# EAGLE design untitled-bruecke (EAGLE 6.3)
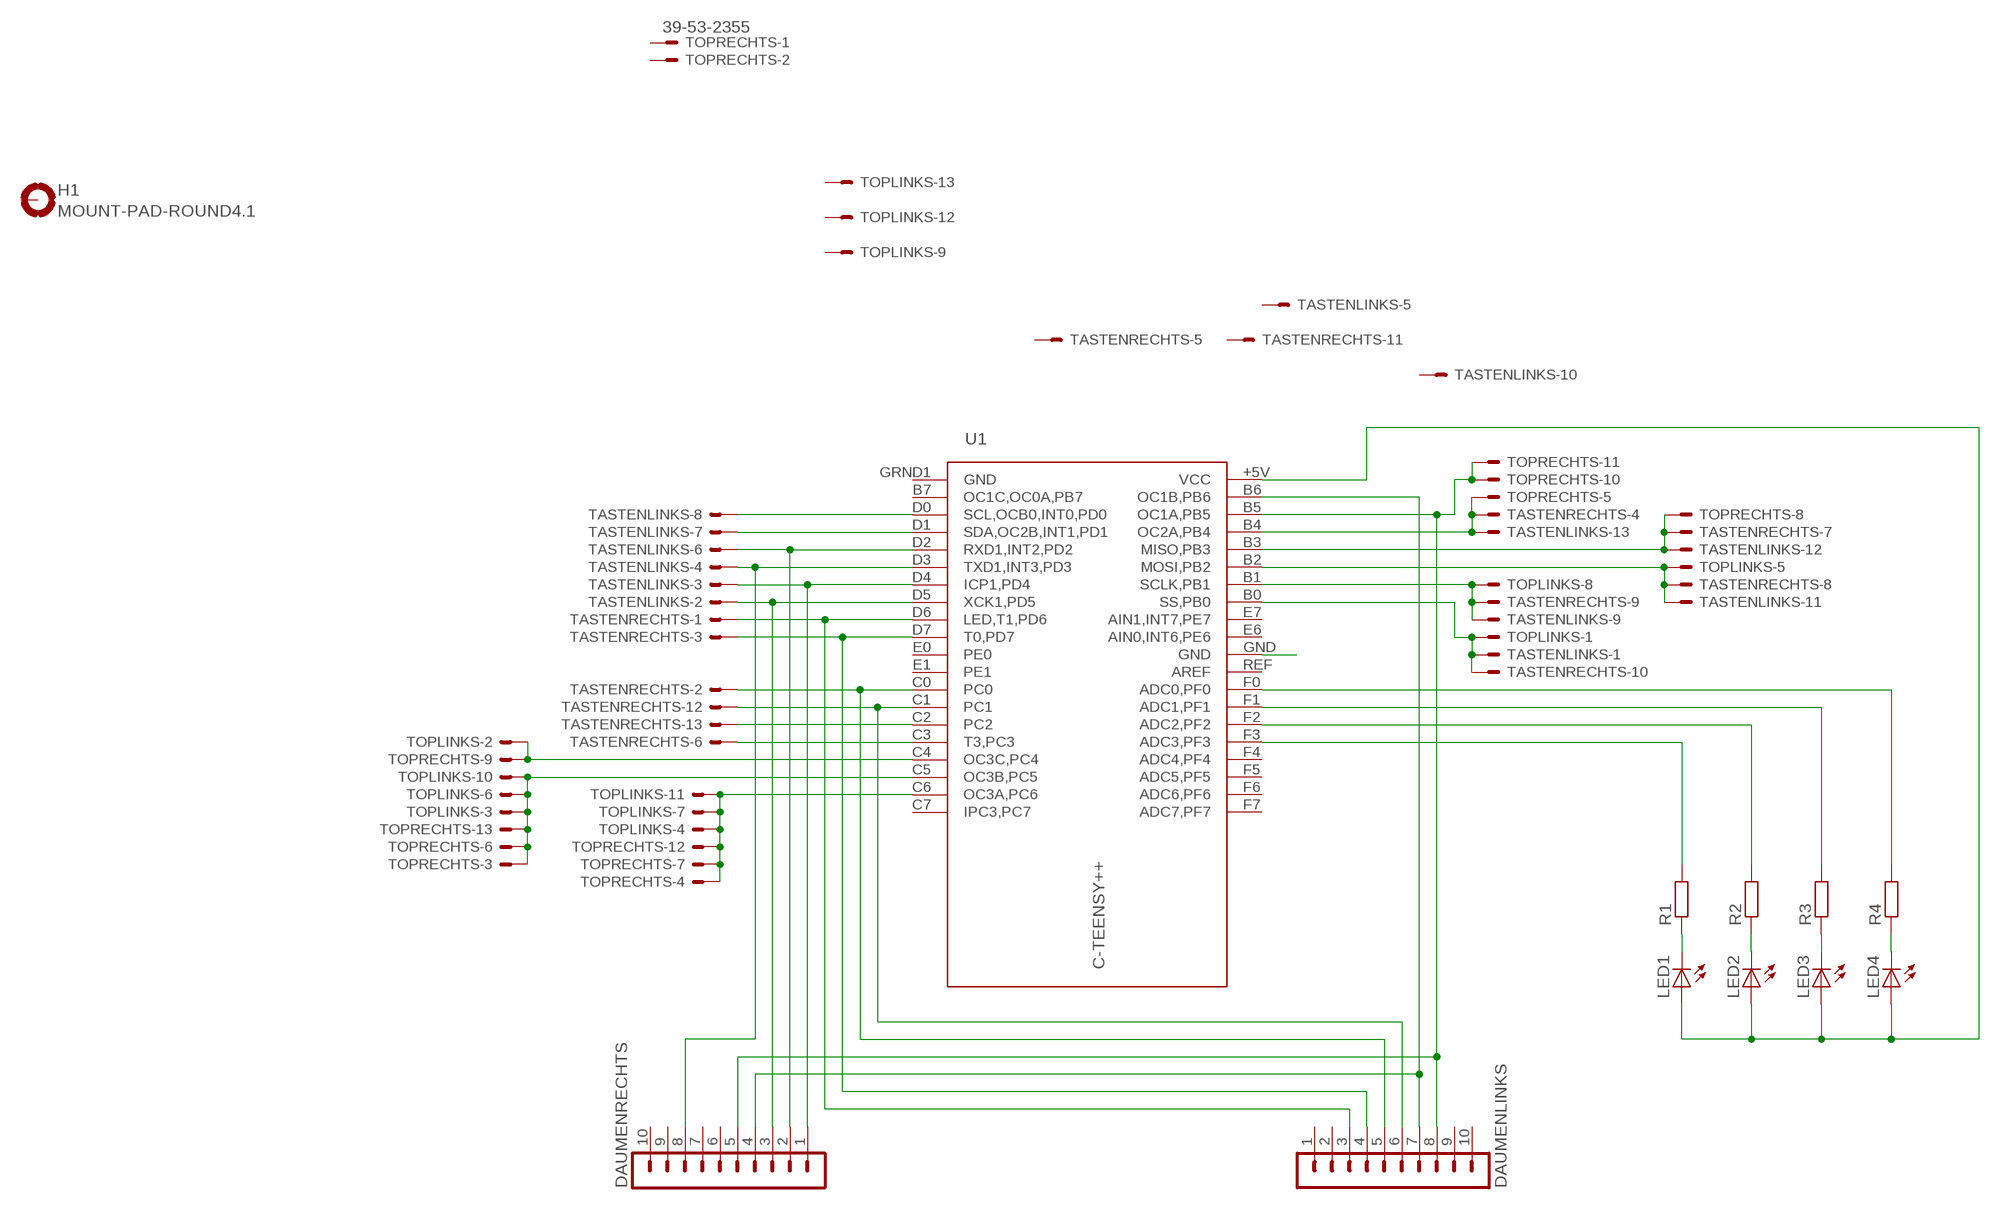
[diagram p0: schematic, sheet 1]

## Parts
DAUMENLINKS  MA10-1  [MA10-1]
DAUMENRECHTS  MA10-1  [MA10-1]
H1  MOUNT-PAD-ROUND4.1  [4,1-PAD]
LED1  LED3MM  [LED3MM]
LED2  LED3MM  [LED3MM]
LED3  LED3MM  [LED3MM]
LED4  LED3MM  [LED3MM]
R1  R-EU_R1206  [R1206]
R2  R-EU_R1206  [R1206]
R3  R-EU_R1206  [R1206]
R4  R-EU_R1206  [R1206]
TASTENLINKS  39-53-2355  [39-53-2135]
TASTENRECHTS  39-53-2355  [39-53-2135]
TOPLINKS  39-53-2355  [39-53-2135]
TOPRECHTS  39-53-2355  [39-53-2135]
U1  C-TEENSY++  [TEENSY++]

## Nets
B0: TASTENLINKS.P$1 TASTENRECHTS.P$10 TOPLINKS.P$1 U1.B0(SS,PB0)
B1: TASTENLINKS.P$9 TASTENRECHTS.P$9 TOPLINKS.P$8 U1.B1(SCLK,PB1)
B2: TASTENLINKS.P$11 TASTENRECHTS.P$8 TOPLINKS.P$5 U1.B2(MOSI,PB2)
B3: TASTENLINKS.P$12 TASTENRECHTS.P$7 TOPRECHTS.P$8 U1.B3(MISO,PB3)
B4: TASTENLINKS.P$13 TASTENRECHTS.P$4 TOPRECHTS.P$5 U1.B4(OC2A,PB4)
B5: DAUMENLINKS.8 DAUMENRECHTS.5 TOPRECHTS.P$10 TOPRECHTS.P$11 U1.B5(OC1A,PB5)
B6: DAUMENLINKS.7 DAUMENRECHTS.4 U1.B6(OC1B,PB6)
C0: DAUMENLINKS.5 TASTENRECHTS.P$2 U1.C0
C1: DAUMENLINKS.6 TASTENRECHTS.P$12 U1.C1
C2: TASTENRECHTS.P$13 U1.C2
C3: TASTENRECHTS.P$6 U1.C3(T3,PC3)
C4: TOPLINKS.P$2 TOPRECHTS.P$9 U1.C4(OC3C,PC4)
C5: TOPLINKS.P$3 TOPLINKS.P$6 TOPLINKS.P$10 TOPRECHTS.P$3 TOPRECHTS.P$6 TOPRECHTS.P$13 U1.C5(OC3B,PC5)
C6: TOPLINKS.P$4 TOPLINKS.P$7 TOPLINKS.P$11 TOPRECHTS.P$4 TOPRECHTS.P$7 TOPRECHTS.P$12 U1.C6(OC3A,PC6)
D0: TASTENLINKS.P$8 U1.D0(SCL,OCB0,INT0,PD0)
D1: TASTENLINKS.P$7 U1.D1(SDA,OC2B,INT1,PD1)
D2: DAUMENRECHTS.2 TASTENLINKS.P$6 U1.D2(RXD1,INT2,PD2)
D3: DAUMENRECHTS.8 TASTENLINKS.P$4 U1.D3(TXD1,INT3,PD3)
D4: DAUMENRECHTS.1 TASTENLINKS.P$3 U1.D4(ICP1,PD4)
D5: DAUMENRECHTS.3 TASTENLINKS.P$2 U1.D5(XCK1,PD5)
D6: DAUMENLINKS.3 TASTENRECHTS.P$1 U1.D6(LED,T1,PD6)
D7: DAUMENLINKS.4 TASTENRECHTS.P$3 U1.D7(T0,PD7)
N$1: U1.GND
N$7: R1.2 U1.F3(ADC3,PF3)
N$8: R2.2 U1.F2(ADC2,PF2)
N$9: R3.2 U1.F1(ADC1,PF1)
N$10: R4.2 U1.F0(ADC0,PF0)
N$11: LED1.A LED2.A LED3.A LED4.A U1.+5V(VCC)
N$14: LED4.K(C) R4.1
N$15: LED3.K(C) R3.1
N$16: LED2.K(C) R2.1
N$17: LED1.K(C) R1.1
Unconnected: DAUMENLINKS.1 DAUMENLINKS.2 DAUMENLINKS.9 DAUMENLINKS.10 DAUMENRECHTS.6 DAUMENRECHTS.7 DAUMENRECHTS.9 DAUMENRECHTS.10 H1.B4,1(MOUNT) TASTENLINKS.P$5 TASTENLINKS.P$10 TASTENRECHTS.P$5 TASTENRECHTS.P$11 TOPLINKS.P$9 TOPLINKS.P$12 TOPLINKS.P$13 TOPRECHTS.P$1 TOPRECHTS.P$2 U1.B7(OC1C,OC0A,PB7) U1.C7(IPC3,PC7) U1.E0 U1.E1 U1.E6(AIN0,INT6,PE6) U1.E7(AIN1,INT7,PE7) U1.F4(ADC4,PF4) U1.F5(ADC5,PF5) U1.F6(ADC6,PF6) U1.F7(ADC7,PF7) U1.REF(AREF)

## Power pins joined to a net without a drawn wire
GND: U1.GRND1(GND)

## Library data of the parts
DAUMENLINKS DAUMENRECHTS = con-lstb:MA10-1: PIN HEADER; OC_FARNELL: unknown; OC_NEWARK: unknown
H1 = holes:MOUNT-PAD-ROUND: MOUNTING PAD, round
LED1-LED4 = led:LED: LED OSRAM: - CHIPLED LG R971, LG N971, LY N971, LG Q971, LY Q971, LO R971, LY R971 LH N974, LH R974 LS Q976, LO Q976, LY Q976 LO Q996 - Hyper CHIPLED LW Q18S LB Q993, LB Q99A, LB R99A - SideLED LS A670, LO A670, LY A670, LG A670, LP A670 LB A673, LV A673, LT A673, LW A673 LH A674 LY A675 LS A676, LA A676, LO A676, LY A676, LW A676 LS A679, LY A679, LG A679 - Hyper Micro SIDELED® LS Y876, LA Y876, LO Y876, LY Y876 LT Y87S - SmartLED LW L88C, LW L88S LB L89C, LB L89S, LG L890 LS L89K, LO L89K, LY L89K LS L896, LA L896, LO L896, LY L896 - TOPLED LS T670, LO T670, LY T670, LG T670, LP T670 LSG T670, LSP T670, LSY T670, LOP T670, LYG T670 LG T671, LOG T671, LSG T671 LB T673, LV T673, LT T673, LW T673 LH T674 LS T676, LA T676, LO T676, LY T676, LB T676, LH T676, LSB T676, LW T676 LB T67C, LV T67C, LT T67C, LS T67K, LO T67K, LY T67K, LW E67C LS E67B, LA E67B, LO E67B, LY E67B, LB E67C, LV E67C, LT E67C LW T67C LS T679, LY T679, LG T679 LS T770, LO T770, LY T770, LG T770, LP T770 LB T773, LV T773, LT T773, LW T773 LH T774 LS E675, LA E675, LY E675, LS T675 LS T776, LA T776, LO T776, LY T776, LB T776 LHGB T686 LT T68C, LB T68C - Hyper Mini TOPLED® LB M676 - Mini TOPLED Santana® LG M470 LS M47K, LO M47K, LY M47K Source: http://www.osram.convergy.de/
R1-R4 = rcl:R-EU_: RESISTOR, European symbol
TASTENLINKS TASTENRECHTS TOPLINKS TOPRECHTS = con-molex-39-53:39-53-2355
U1 = teensypp:C-TEENSY++

## Board
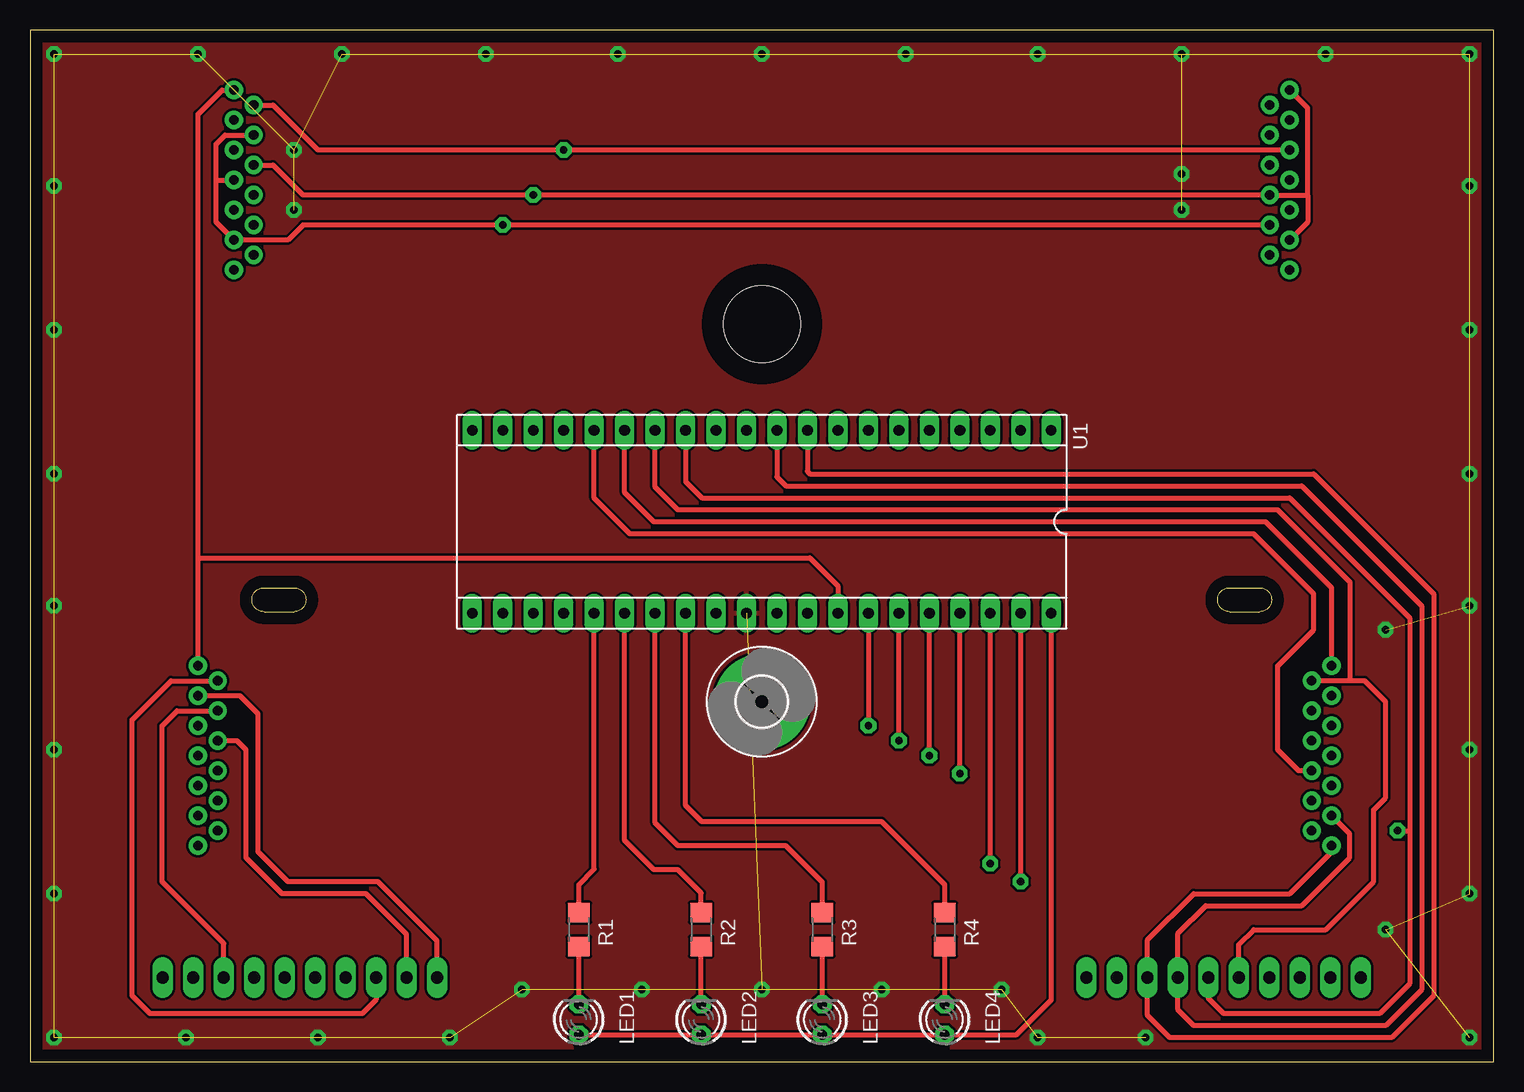
[diagram p1: board, top side]
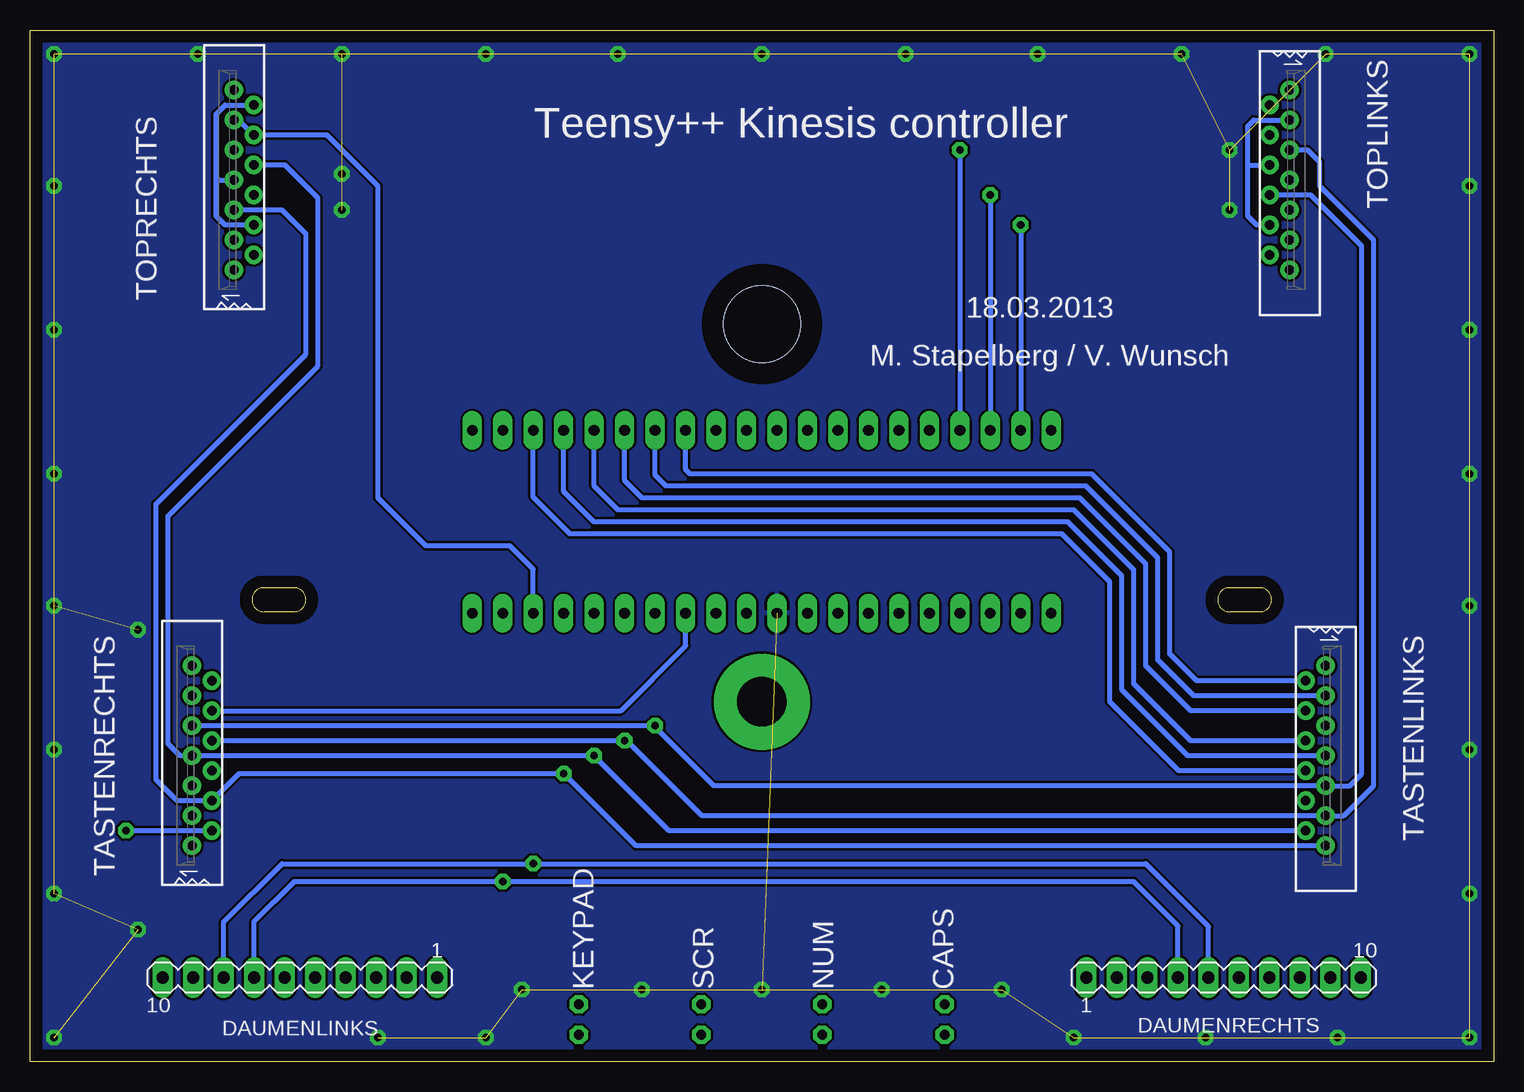
[diagram p2: board, bottom side, seen from below]

Size 122 x 86 mm. Coordinates in mm from the lower left corner, seen from the top.
Outline: 0,0 122,0 122,86 0,86 0,0
Outline: 19.5,37.5 22,37.5 arc90 23,38.5 arc90 22,39.5 19.5,39.5 arc90 18.5,38.5 arc90 19.5,37.5
Outline: 100,37.5 102.5,37.5 arc90 103.5,38.5 arc90 102.5,39.5 100,39.5 arc90 99,38.5 arc90 100,37.5
Copper layers (1*16): Top 0.035mm / dielectric 1.5mm / Bottom 0.035mm
Design rules "default": minimum track width 10mil, minimum drill 0.6mm, track to track 8mil, track to pad 8mil, pad to pad 8mil, via to via 8mil, smd to smd 8mil, copper to edge 40mil, drill to drill 8mil, minimum pad ring 14mil, minimum via ring 14mil, stop-mask expansion 4mil, vias tented up to drill 0.65mm, thermal gap 10mil
Holes 6.4 mm at 61,61.5
tKeepout: area 56,56.5 to 66,66.5
bKeepout: area 56,56.5 to 66,66.5
tRestrict: area 56,56.5 to 66,66.5
bRestrict: area 56,56.5 to 66,66.5
vRestrict: area 56,56.5 to 66,66.5

### Footprints (pad centres in the part's own frame; a part is rotated, then mirrored left to right if it is on the bottom)
MA10-1 = drill 1.016 long: 1 -11.43,0; 2 -8.89,0; 3 -6.35,0; 4 -3.81,0; 5 -1.27,0; 6 1.27,0; 7 3.81,0; 8 6.35,0; 9 8.89,0; 10 11.43,0
4,1-PAD = drill 4.1 pad 8: B4,1 0,0
LED3MM = drill 0.813 octagon: A -1.27,0; K 1.27,0
R1206 = smd 1.6 x 1.803: 1 -1.422,0; 2 1.422,0
39-53-2135 = drill 0.8: P$1 -7.5,0; P$2 -6.25,-1.65; P$3 -5,0; P$4 -3.75,-1.65; P$5 -2.5,0; P$6 -1.25,-1.65; P$7 0,0; P$8 1.25,-1.65; P$9 2.5,0; P$10 3.75,-1.65; P$11 5,0; P$12 6.25,-1.65; P$13 7.5,0
TEENSY++ = drill 0.9 long: +5V -24.13,7.62; B0 -6.35,7.62; B1 -8.89,7.62; B2 -11.43,7.62; B3 -13.97,7.62; B4 -16.51,7.62; B5 -19.05,7.62; B6 -21.59,7.62; B7 -21.59,-7.62; C0 6.35,-7.62; C1 8.89,-7.62; C2 11.43,-7.62; C3 13.97,-7.62; C4 16.51,-7.62; C5 19.05,-7.62; C6 21.59,-7.62; C7 24.13,-7.62; D0 -19.05,-7.62; D1 -16.51,-7.62; D2 -13.97,-7.62; D3 -11.43,-7.62; D4 -8.89,-7.62; D5 -6.35,-7.62; D6 -3.81,-7.62; D7 -1.27,-7.62; E0 1.27,-7.62; E1 3.81,-7.62; E6 -1.27,7.62; E7 -3.81,7.62; F0 6.35,7.62; F1 8.89,7.62; F2 11.43,7.62; F3 13.97,7.62; F4 16.51,7.62; F5 19.05,7.62; F6 21.59,7.62; F7 24.13,7.62; GND -24.13,-7.62; GRND1 1.27,7.62; REF 3.81,7.62

### Placement (x,y rotation side)
DAUMENLINKS  99.5,7 180 bottom
DAUMENRECHTS  22.5,7 0 bottom
H1  61,30 0 top
LED1  45.75,3.5 90 top
LED2  55.95,3.5 90 top
LED3  66.05,3.5 90 top
LED4  76.25,3.5 90 top
R1  45.75,11 90 top
R2  55.95,11 90 top
R3  66.05,11 90 top
R4  76.25,11 90 top
TASTENLINKS  14,25.5 270 bottom
TASTENRECHTS  108.5,25.5 90 bottom
TOPLINKS  17,73.5 270 bottom
TOPRECHTS  105,73.5 90 bottom
U1  61,45 180 top

### Tracks (layer width: path | path; a pad name or v marks a point on that pad's centre or on a via)
B0
  Top 0.406: TASTENLINKS.P$1 14,42 | 14,42 65,42 67.35,39.65 U1.B0 | 14,42 14,79 16,81 TOPLINKS.P$1
  Bottom 0.406: TASTENRECHTS.P$10 72.75,29.25 67.35,34.65 U1.B0
B1  (via drill 0.6)
  Top 0.406: U1.B1 v69.89,28
  Bottom 0.406: 70,28 65,23 TASTENLINKS.P$9 12,23 11,24 11,68 15.25,72.25 TOPLINKS.P$8 | 70,28 TASTENRECHTS.P$9 | v69.89,28 70,28
B2  (via drill 0.6)
  Top 0.406: v72.43,26.75 U1.B2
  Bottom 0.406: TASTENRECHTS.P$8 v72.43,26.75 72.25,26.75 66,20.5 TASTENLINKS.P$11 12.5,20.5 10,23 10,68.5 14.5,73 14.5,75 15.5,76 TOPLINKS.P$5
B3  (via drill 0.6)
  Top 0.406: v74.97,25.5 U1.B3
  Bottom 0.406: TASTENLINKS.P$12 68.75,19.25 75,25.5 | 75,25.5 TASTENRECHTS.P$7 109.5,25.5 110.5,26.5 110.5,45.5 98,58 98,72 100.75,74.75 TOPRECHTS.P$8 | 75,25.5 v74.97,25.5
B4  (via drill 0.6)
  Top 0.406: v77.51,24 U1.B4
  Bottom 0.406: TASTENLINKS.P$13 71.5,18 v77.5,24 v77.51,24 104.6,24 TASTENRECHTS.P$4 109.75,21.75 111.5,23.5 111.5,46.5 99,59 99,69 101,71 TOPRECHTS.P$5
B5  (via drill 0.6)
  Top 0.406: v80.05,16.5 U1.B5
  Bottom 0.406: DAUMENLINKS.8 105.85,11.65 101,16.5 v80.05,16.5 29,16.5 23.77,11.27 DAUMENRECHTS.5 | U1.B5 80.05,41.05 82,43 89,43 93,47 93,73 97.25,77.25 TOPRECHTS.P$10 104.6,78.5 TOPRECHTS.P$11
B6  (via drill 0.6)
  Top 0.406: v82.59,15 U1.B6
  Bottom 0.406: DAUMENRECHTS.4 26.31,11.31 30,15 v82.59,15 100,15 103.31,11.69 DAUMENLINKS.7
C0  (via drill 0.6)
  Top 0.406: U1.C0 54.65,48.35 56,47 105,47 115,37 115,19.25 | 115,19.25 115,6.5 112.5,4 99.5,4 98.23,5.27 DAUMENLINKS.5 | v114,19.25 115,19.25
  Bottom 0.406: TASTENRECHTS.P$2 v114,19.25
C1
  Top 0.406: DAUMENLINKS.6 100.77,9.77 102,11 108,11 112,15 112,21 113,22 113,30 111.25,31.75 110.05,31.75 | 110.05,31.75 TASTENRECHTS.P$12 | 110.05,31.75 110.05,39.95 104,46 54,46 52.11,47.89 U1.C1
C2
  Top 0.406: TASTENRECHTS.P$13 108.5,39.5 103,45 52,45 49.57,47.43 U1.C2
C3
  Top 0.406: TASTENRECHTS.P$6 105.75,24.25 104,26 104,33 107,36 107,39 102,44 50,44 47.03,46.97 U1.C3
C4  (via drill 0.6)
  Top 0.406: TOPRECHTS.P$9 v44.49,76 24,76 20.25,79.75 TOPLINKS.P$2
  Bottom 0.406: v44.49,76 U1.C4
C5  (via drill 0.6)
  Top 0.406: TOPLINKS.P$6 20.25,74.75 22.75,72.25 v41.95,72.25 TOPRECHTS.P$6 106.5,72.25 | 106.5,72.25 106.5,70 TOPRECHTS.P$3 | 106.5,72.25 106.5,79.5 TOPRECHTS.P$13
  Bottom 0.406: TOPLINKS.P$10 19.75,69.75 20.5,70.5 20.5,74.75 | 20.5,74.75 TOPLINKS.P$6 | 20.5,74.75 20.5,78 20,78.5 TOPLINKS.P$3 | v41.95,72.25 U1.C5
C6  (via drill 0.6)
  Top 0.406: TOPRECHTS.P$4 v39.41,69.75 22.75,69.75 21.5,68.5 TOPLINKS.P$11 15.5,70 15.5,73.5 | 15.5,73.5 TOPLINKS.P$7 | 15.5,73.5 15.5,76.5 16.25,77.25 TOPLINKS.P$4
  Bottom 0.406: TOPRECHTS.P$4 105.75,69.75 106.5,70.5 106.5,73.5 | 106.5,73.5 TOPRECHTS.P$7 | 106.5,73.5 106.5,79 105.75,79.75 TOPRECHTS.P$12 | v39.41,69.75 U1.C6
D0
  Bottom 0.406: TASTENLINKS.P$8 26.25,24.25 32,30 32,40 36,44 77,44 80.05,47.05 U1.D0
D1
  Bottom 0.406: TASTENLINKS.P$7 25.5,25.5 31,31 31,40.5 35.5,45 75,45 77.51,47.51 U1.D1
D2
  Top 0.406: DAUMENRECHTS.2 31.39,10.61 28,14 21,14 18,17 18,26 17.25,26.75 TASTENLINKS.P$6
  Bottom 0.406: TASTENLINKS.P$6 25.25,26.75 30,31.5 30,41 35,46 73,46 74.97,47.97 U1.D2
D3
  Top 0.406: DAUMENRECHTS.8 16.15,9.85 11,15 11,28 12.25,29.25 TASTENLINKS.P$4
  Bottom 0.406: TASTENLINKS.P$4 25.25,29.25 29,33 29,41.5 34.5,47 71,47 72.43,48.43 U1.D3
D4
  Top 0.406: DAUMENRECHTS.1 33.93,10.07 29,15 21.5,15 19,17.5 19,29 17.5,30.5 TASTENLINKS.P$3
  Bottom 0.406: TASTENLINKS.P$3 25,30.5 28,33.5 28,42 34,48 69,48 69.89,48.89 U1.D4
D5
  Top 0.406: DAUMENRECHTS.3 28.85,5.15 27.7,4 10,4 8.5,5.5 8.5,28.5 11.75,31.75 TASTENLINKS.P$2
  Bottom 0.406: TASTENLINKS.P$2 24.75,31.75 27,34 27,42.5 33.5,49 67,49 67.35,49.35 U1.D5
D6
  Top 0.406: TASTENRECHTS.P$1 108.5,17.5 105,14 97,14 93.15,10.15 DAUMENLINKS.3 93.15,3.85 95,2 113.5,2 117,5.5 117,39 107,49 65,49 64.81,49.19 U1.D6
D7
  Top 0.406: TASTENRECHTS.P$3 110,19 110,17 106,13 98,13 95.69,10.69 DAUMENLINKS.4 95.69,4.31 97,3 113,3 116,6 116,38 106,48 63,48 62.27,48.73 U1.D7
GND  (via drill 0.6)  (41 unrouted)
  other vias: 2,2 120,2 120,84 2,84 61,84 61,6 71,6 51,6 41,6 81,6 24,2 35,2 13,2 93,2 84,2 26,84 38,84 14,84 73,84 49,84 96,84 84,84 108,84 120,61 120,73 120,49 120,26 120,38 120,14 2,26 2,38 2,14 2,61 2,73 2,49 22,76 96,74 22,71 96,71 113,11 113,36
  pour Top: 1,85 1,1 121,1 121,85
  pour Bottom: 1,85 1,1 121,1 121,85
N$7
  Top 0.406: R1.2 45.75,14.75 47.03,16.03 U1.F3
N$8
  Top 0.406: R2.2 55.95,14.05 54,16 52,16 49.57,18.43 U1.F2
N$9
  Top 0.406: R3.2 66.05,14.95 63,18 54,18 52.11,19.89 U1.F1
N$10
  Top 0.406: R4.2 76.25,14.75 71,20 56,20 54.65,21.35 U1.F0
N$11
  Top 0.406: LED1.A LED2.A LED3.A LED4.A 82.23,2.23 85.13,5.13 U1.+5V
N$14
  Top 0.406: LED4.K R4.1
N$15
  Top 0.406: LED3.K R3.1
N$16
  Top 0.406: LED2.K R2.1
N$17
  Top 0.406: LED1.K R1.1

### Text on the board
bNames: Teensy++ Kinesis controller | 18.03.2013 | M. Stapelberg / V. Wunsch | CAPS | NUM | SCR | KEYPAD